# EAGLE schematic master_teststand_v1 (EAGLE 9.6.2)
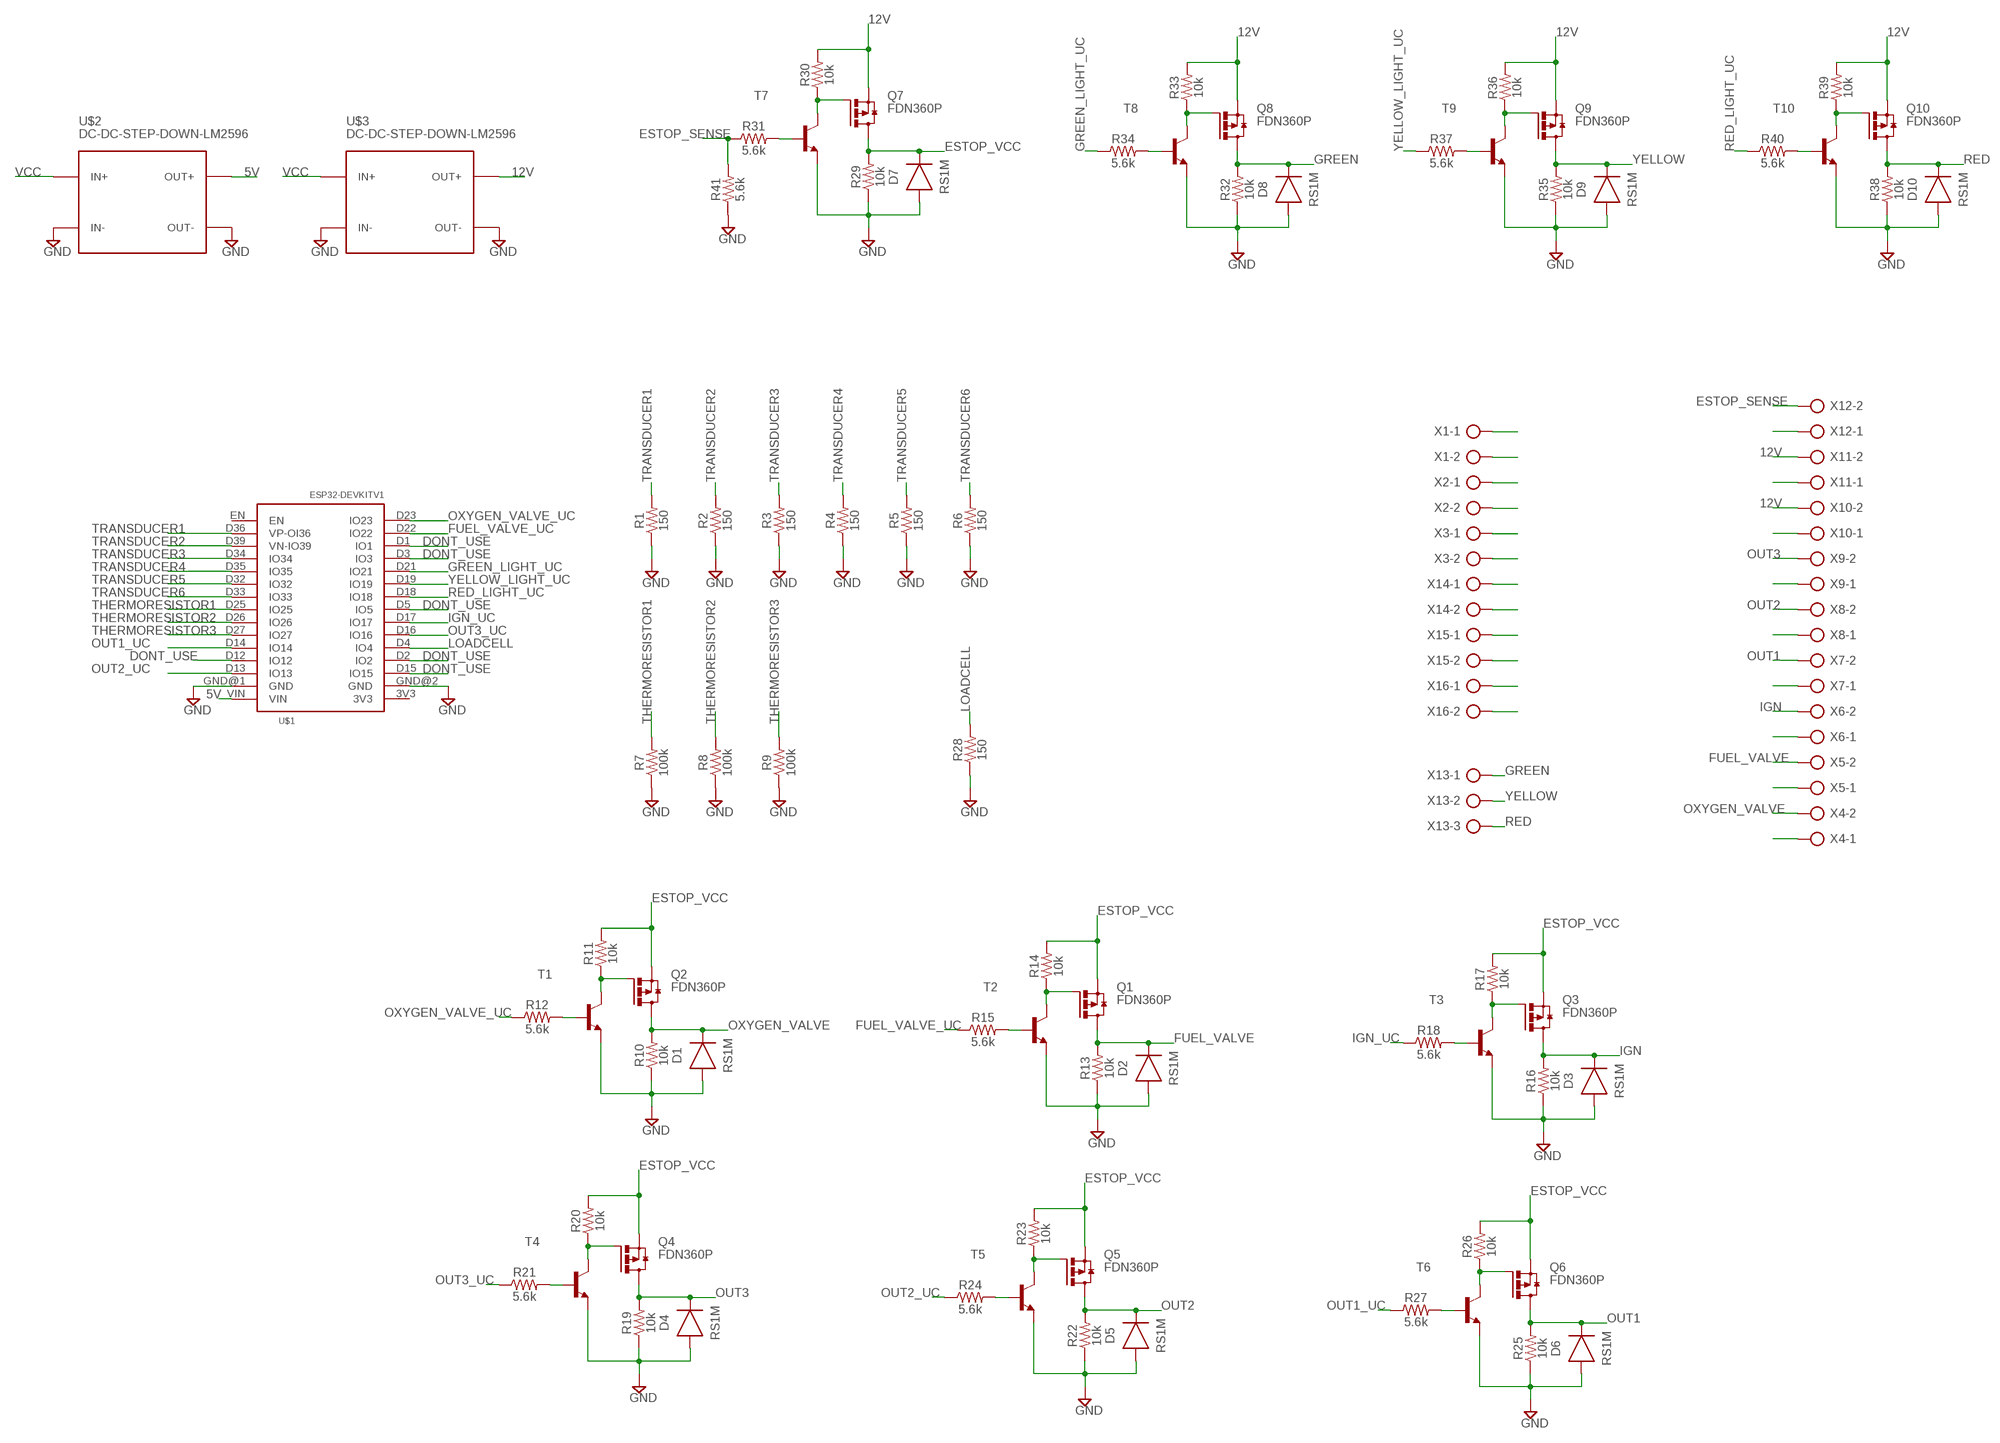
[diagram p0: schematic, sheet 1]

## Parts
D1  RS1M  DIODE_RS1M_SMA  [DIOM5226X290N]
D2  RS1M  DIODE_RS1M_SMA  [DIOM5226X290N]
D3  RS1M  DIODE_RS1M_SMA  [DIOM5226X290N]
D4  RS1M  DIODE_RS1M_SMA  [DIOM5226X290N]
D5  RS1M  DIODE_RS1M_SMA  [DIOM5226X290N]
D6  RS1M  DIODE_RS1M_SMA  [DIOM5226X290N]
D7  RS1M  DIODE_RS1M_SMA  [DIOM5226X290N]
D8  RS1M  DIODE_RS1M_SMA  [DIOM5226X290N]
D9  RS1M  DIODE_RS1M_SMA  [DIOM5226X290N]
D10  RS1M  DIODE_RS1M_SMA  [DIOM5226X290N]
Q1  FDN360P  [SUPER-SOT3]
Q2  FDN360P  [SUPER-SOT3]
Q3  FDN360P  [SUPER-SOT3]
Q4  FDN360P  [SUPER-SOT3]
Q5  FDN360P  [SUPER-SOT3]
Q6  FDN360P  [SUPER-SOT3]
Q7  FDN360P  [SUPER-SOT3]
Q8  FDN360P  [SUPER-SOT3]
Q9  FDN360P  [SUPER-SOT3]
Q10  FDN360P  [SUPER-SOT3]
R1  150  150OHM-0603-1/10W-1%  [0603]
R2  150  150OHM-0603-1/10W-1%  [0603]
R3  150  150OHM-0603-1/10W-1%  [0603]
R4  150  150OHM-0603-1/10W-1%  [0603]
R5  150  150OHM-0603-1/10W-1%  [0603]
R6  150  150OHM-0603-1/10W-1%  [0603]
R7  100k  100KOHM-0603-1/10W-1%  [0603]
R8  100k  100KOHM-0603-1/10W-1%  [0603]
R9  100k  100KOHM-0603-1/10W-1%  [0603]
R10  10k  10KOHM-0603-1/10W-1%  [0603]
R11  10k  10KOHM-0603-1/10W-1%  [0603]
R12  5.6k  5.6KOHM-0603-1/10W-1%  [0603]
R13  10k  10KOHM-0603-1/10W-1%  [0603]
R14  10k  10KOHM-0603-1/10W-1%  [0603]
R15  5.6k  5.6KOHM-0603-1/10W-1%  [0603]
R16  10k  10KOHM-0603-1/10W-1%  [0603]
R17  10k  10KOHM-0603-1/10W-1%  [0603]
R18  5.6k  5.6KOHM-0603-1/10W-1%  [0603]
R19  10k  10KOHM-0603-1/10W-1%  [0603]
R20  10k  10KOHM-0603-1/10W-1%  [0603]
R21  5.6k  5.6KOHM-0603-1/10W-1%  [0603]
R22  10k  10KOHM-0603-1/10W-1%  [0603]
R23  10k  10KOHM-0603-1/10W-1%  [0603]
R24  5.6k  5.6KOHM-0603-1/10W-1%  [0603]
R25  10k  10KOHM-0603-1/10W-1%  [0603]
R26  10k  10KOHM-0603-1/10W-1%  [0603]
R27  5.6k  5.6KOHM-0603-1/10W-1%  [0603]
R28  150  150OHM-0603-1/10W-1%  [0603]
R29  10k  10KOHM-0603-1/10W-1%  [0603]
R30  10k  10KOHM-0603-1/10W-1%  [0603]
R31  5.6k  5.6KOHM-0603-1/10W-1%  [0603]
R32  10k  10KOHM-0603-1/10W-1%  [0603]
R33  10k  10KOHM-0603-1/10W-1%  [0603]
R34  5.6k  5.6KOHM-0603-1/10W-1%  [0603]
R35  10k  10KOHM-0603-1/10W-1%  [0603]
R36  10k  10KOHM-0603-1/10W-1%  [0603]
R37  5.6k  5.6KOHM-0603-1/10W-1%  [0603]
R38  10k  10KOHM-0603-1/10W-1%  [0603]
R39  10k  10KOHM-0603-1/10W-1%  [0603]
R40  5.6k  5.6KOHM-0603-1/10W-1%  [0603]
R41  5.6k  5.6KOHM-0603-1/10W-1%  [0603]
T1  MMBT2222ALT1-NPN-SOT23-BEC  [SOT23-BEC]
T2  MMBT2222ALT1-NPN-SOT23-BEC  [SOT23-BEC]
T3  MMBT2222ALT1-NPN-SOT23-BEC  [SOT23-BEC]
T4  MMBT2222ALT1-NPN-SOT23-BEC  [SOT23-BEC]
T5  MMBT2222ALT1-NPN-SOT23-BEC  [SOT23-BEC]
T6  MMBT2222ALT1-NPN-SOT23-BEC  [SOT23-BEC]
T7  MMBT2222ALT1-NPN-SOT23-BEC  [SOT23-BEC]
T8  MMBT2222ALT1-NPN-SOT23-BEC  [SOT23-BEC]
T9  MMBT2222ALT1-NPN-SOT23-BEC  [SOT23-BEC]
T10  MMBT2222ALT1-NPN-SOT23-BEC  [SOT23-BEC]
U$1  ESP32DEVKITV1  [ESP32-DEVKITV1]
U$2  DC-DC-STEP-DOWN-LM2596  [DC-DC-STEP-DOWN-LM2596]
U$3  DC-DC-STEP-DOWN-LM2596  [DC-DC-STEP-DOWN-LM2596]
X1  AK300/2  [AK300/2]
X2  AK300/2  [AK300/2]
X3  AK300/2  [AK300/2]
X4  AK300/2  [AK300/2]
X5  AK300/2  [AK300/2]
X6  AK300/2  [AK300/2]
X7  AK300/2  [AK300/2]
X8  AK300/2  [AK300/2]
X9  AK300/2  [AK300/2]
X10  AK300/2  [AK300/2]
X11  AK300/2  [AK300/2]
X12  AK300/2  [AK300/2]
X13  AK300/3  [AK300/3]
X14  AK300/2  [AK300/2]
X15  AK300/2  [AK300/2]
X16  AK300/2  [AK300/2]

## Nets
5V: U$1.VIN U$2.OUT+
12V: Q7.2(S) Q8.2(S) Q9.2(S) Q10.2(S) R30.2 R33.2 R36.2 R39.2 U$3.OUT+ X10.2 X11.2
DONT_USE: U$1.D1(IO1) U$1.D2(IO2) U$1.D3(IO3) U$1.D5(IO5) U$1.D12(IO12) U$1.D15(IO15)
ESTOP_SENSE: R31.1 R41.2 X12.2
ESTOP_SENSE1: X1.2
ESTOP_SENSE2: X2.2
ESTOP_SENSE3: X3.2
ESTOP_SENSE4: X14.2
ESTOP_SENSE5: X15.2
ESTOP_SENSE6: X16.2
ESTOP_VCC: D7.1(C) Q1.2(S) Q2.2(S) Q3.2(S) Q4.2(S) Q5.2(S) Q6.2(S) Q7.3(D) R11.2 R14.2 R17.2 R20.2 R23.2 R26.2 R29.2
FUEL_VALVE: D2.1(C) Q1.3(D) R13.2 X5.2
FUEL_VALVE_UC: R15.1 U$1.D22(IO22)
GND: D1.2(A) D2.2(A) D3.2(A) D4.2(A) D5.2(A) D6.2(A) D7.2(A) D8.2(A) D9.2(A) D10.2(A) R1.1 R2.1 R3.1 R4.1 R5.1 R6.1 R7.1 R8.1 R9.1 R10.1 R13.1 R16.1 R19.1 R22.1 R25.1 R28.1 R29.1 R32.1 R35.1 R38.1 R41.1 T1.E T2.E T3.E T4.E T5.E T6.E T7.E T8.E T9.E T10.E U$1.GND@1(GND) U$1.GND@2(GND) U$2.IN- U$2.OUT- U$3.IN- U$3.OUT-
GREEN: D8.1(C) Q8.3(D) R32.2 X13.1
GREEN_LIGHT_UC: R34.1 U$1.D21(IO21)
IGN: D3.1(C) Q3.3(D) R16.2 X6.2
IGN_UC: R18.1 U$1.D17(IO17)
LOADCELL: R28.2 U$1.D4(IO4)
N$1: Q1.1(G) R14.1 T2.C
N$2: R15.2 T2.B
N$3: Q2.1(G) R11.1 T1.C
N$4: Q3.1(G) R17.1 T3.C
N$5: R12.2 T1.B
N$6: R18.2 T3.B
N$7: Q4.1(G) R20.1 T4.C
N$8: R21.2 T4.B
N$9: Q5.1(G) R23.1 T5.C
N$10: R24.2 T5.B
N$11: Q6.1(G) R26.1 T6.C
N$12: R27.2 T6.B
N$13: Q7.1(G) R30.1 T7.C
N$14: R31.2 T7.B
N$15: Q8.1(G) R33.1 T8.C
N$16: R34.2 T8.B
N$17: Q9.1(G) R36.1 T9.C
N$18: R37.2 T9.B
N$19: Q10.1(G) R39.1 T10.C
N$20: R40.2 T10.B
N$21: X1.1
N$22: X11.1
N$23: X2.1
N$24: X12.1
N$25: X3.1
N$26: X14.1
N$27: X15.1
N$28: X16.1
N$31: X10.1
N$33: X9.1
N$37: X7.1
N$39: X6.1
N$41: X5.1
N$43: X4.1
OUT1: D6.1(C) Q6.3(D) R25.2 X7.2
OUT1_UC: R27.1 U$1.D14(IO14)
OUT2: D5.1(C) Q5.3(D) R22.2 X8.1 X8.2
OUT2_UC: R24.1 U$1.D13(IO13)
OUT3: D4.1(C) Q4.3(D) R19.2 X9.2
OUT3_UC: R21.1 U$1.D16(IO16)
OXYGEN_VALVE: D1.1(C) Q2.3(D) R10.2 X4.2
OXYGEN_VALVE_UC: R12.1 U$1.D23(IO23)
RED: D10.1(C) Q10.3(D) R38.2 X13.3
RED_LIGHT_UC: R40.1 U$1.D18(IO18)
THERMORESISTOR1: R7.2 U$1.D25(IO25)
THERMORESISTOR2: R8.2 U$1.D26(IO26)
THERMORESISTOR3: R9.2 U$1.D27(IO27)
TRANSDUCER1: R1.2 U$1.D36(VP-OI36)
TRANSDUCER2: R2.2 U$1.D39(VN-IO39)
TRANSDUCER3: R3.2 U$1.D34(IO34)
TRANSDUCER4: R4.2 U$1.D35(IO35)
TRANSDUCER5: R5.2 U$1.D32(IO32)
TRANSDUCER6: R6.2 U$1.D33(IO33)
VCC: U$2.IN+ U$3.IN+
YELLOW: D9.1(C) Q9.3(D) R35.2 X13.2
YELLOW_LIGHT_UC: R37.1 U$1.D19(IO19)
Unconnected: U$1.3V3 U$1.EN

## Library data of the parts
D1-D10 = Diode:DIODE_: Diode Rectifier - Popular parts; CATEGORY: Diode; DESCRIPTION: DIODE GEN PURP 1KV 1A SMA; MANUFACTURER: ON Semiconductor; SUB-CATEGORY: Rectifier
Q1-Q10 = transistor-power:FDN360P: Single P-Channel, PowerTrench (R) MOSFET Source: http://www.fairchildsemi.com/ds/FD/FDN360P.pdf
R1-R6 R28 = SparkFun-Resistors:150OHM: 150Ω resistor A resistor is a passive two-terminal electrical component that implements electrical resistance as a circuit element. Resistors act to reduce current flow, and, at the same time, act to lower voltage levels within circuits. - Wikipedia; PROD_ID: RES-11028
R7-R9 = SparkFun-Resistors:100KOHM: 100kΩ resistor A resistor is a passive two-terminal electrical component that implements electrical resistance as a circuit element. Resistors act to reduce current flow, and, at the same time, act to lower voltage levels within circuits. - Wikipedia; PROD_ID: RES-07828
R10 R11 R13 R14 R16 R17 R19 R20 R22 R23 R25 R26 R29 R30 R32 R33 R35 R36 R38 R39 = SparkFun-Resistors:10KOHM: 10kΩ resistor A resistor is a passive two-terminal electrical component that implements electrical resistance as a circuit element. Resistors act to reduce current flow, and, at the same time, act to lower voltage levels within circuits. - Wikipedia; PROD_ID: RES-00824
R12 R15 R18 R21 R24 R27 R31 R34 R37 R40 R41 = SparkFun-Resistors:5.6KOHM: 5.6kΩ resistor A resistor is a passive two-terminal electrical component that implements electrical resistance as a circuit element. Resistors act to reduce current flow, and, at the same time, act to lower voltage levels within circuits. - Wikipedia; PROD_ID: RES-12378
T1-T10 = transistor-neu-to92:*-NPN-: NPN Transistror
U$1 = ESP32-DEVKITV1:ESP32DEVKITV1
U$2 U$3 = 1484249208697-powermodules:DC-DC-STEP-DOWN-LM2596: DC/DC Step-Down Regulator based on LM2596-ADJ chip
X1-X12 X14-X16 = con-ptr500:AK300/2: CONNECTOR; OC_FARNELL: unknown; OC_NEWARK: unknown
X13 = con-ptr500:AK300/3: CONNECTOR; OC_FARNELL: unknown; OC_NEWARK: unknown